# Altium schematic sheet MicroController.SchDoc: MicroController Block Diagram
size 393 x 281 mm; DocumentNumber: 14; SheetNumber: 15; SheetTotal: 44
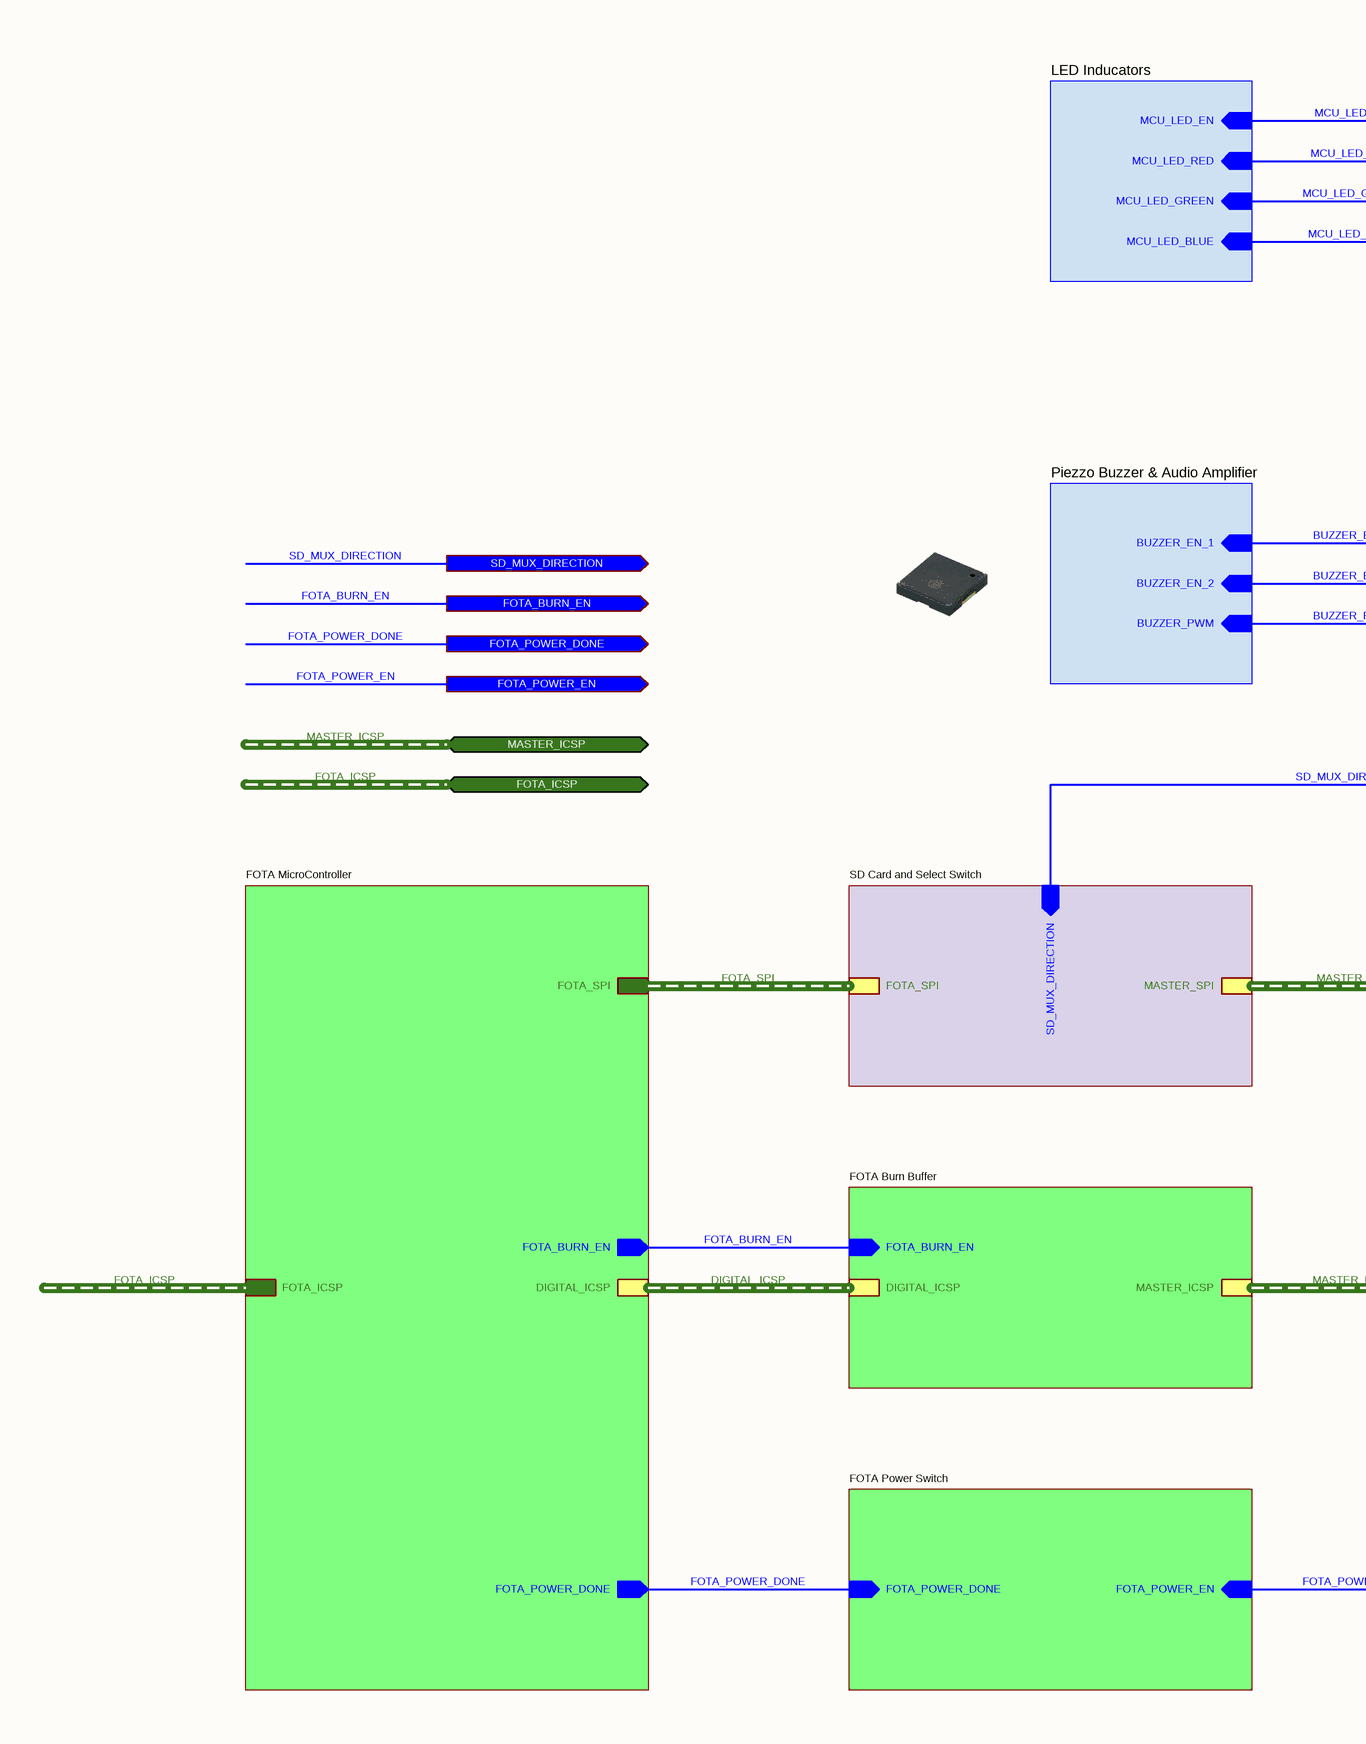
[diagram p0: MicroController.SchDoc, left]
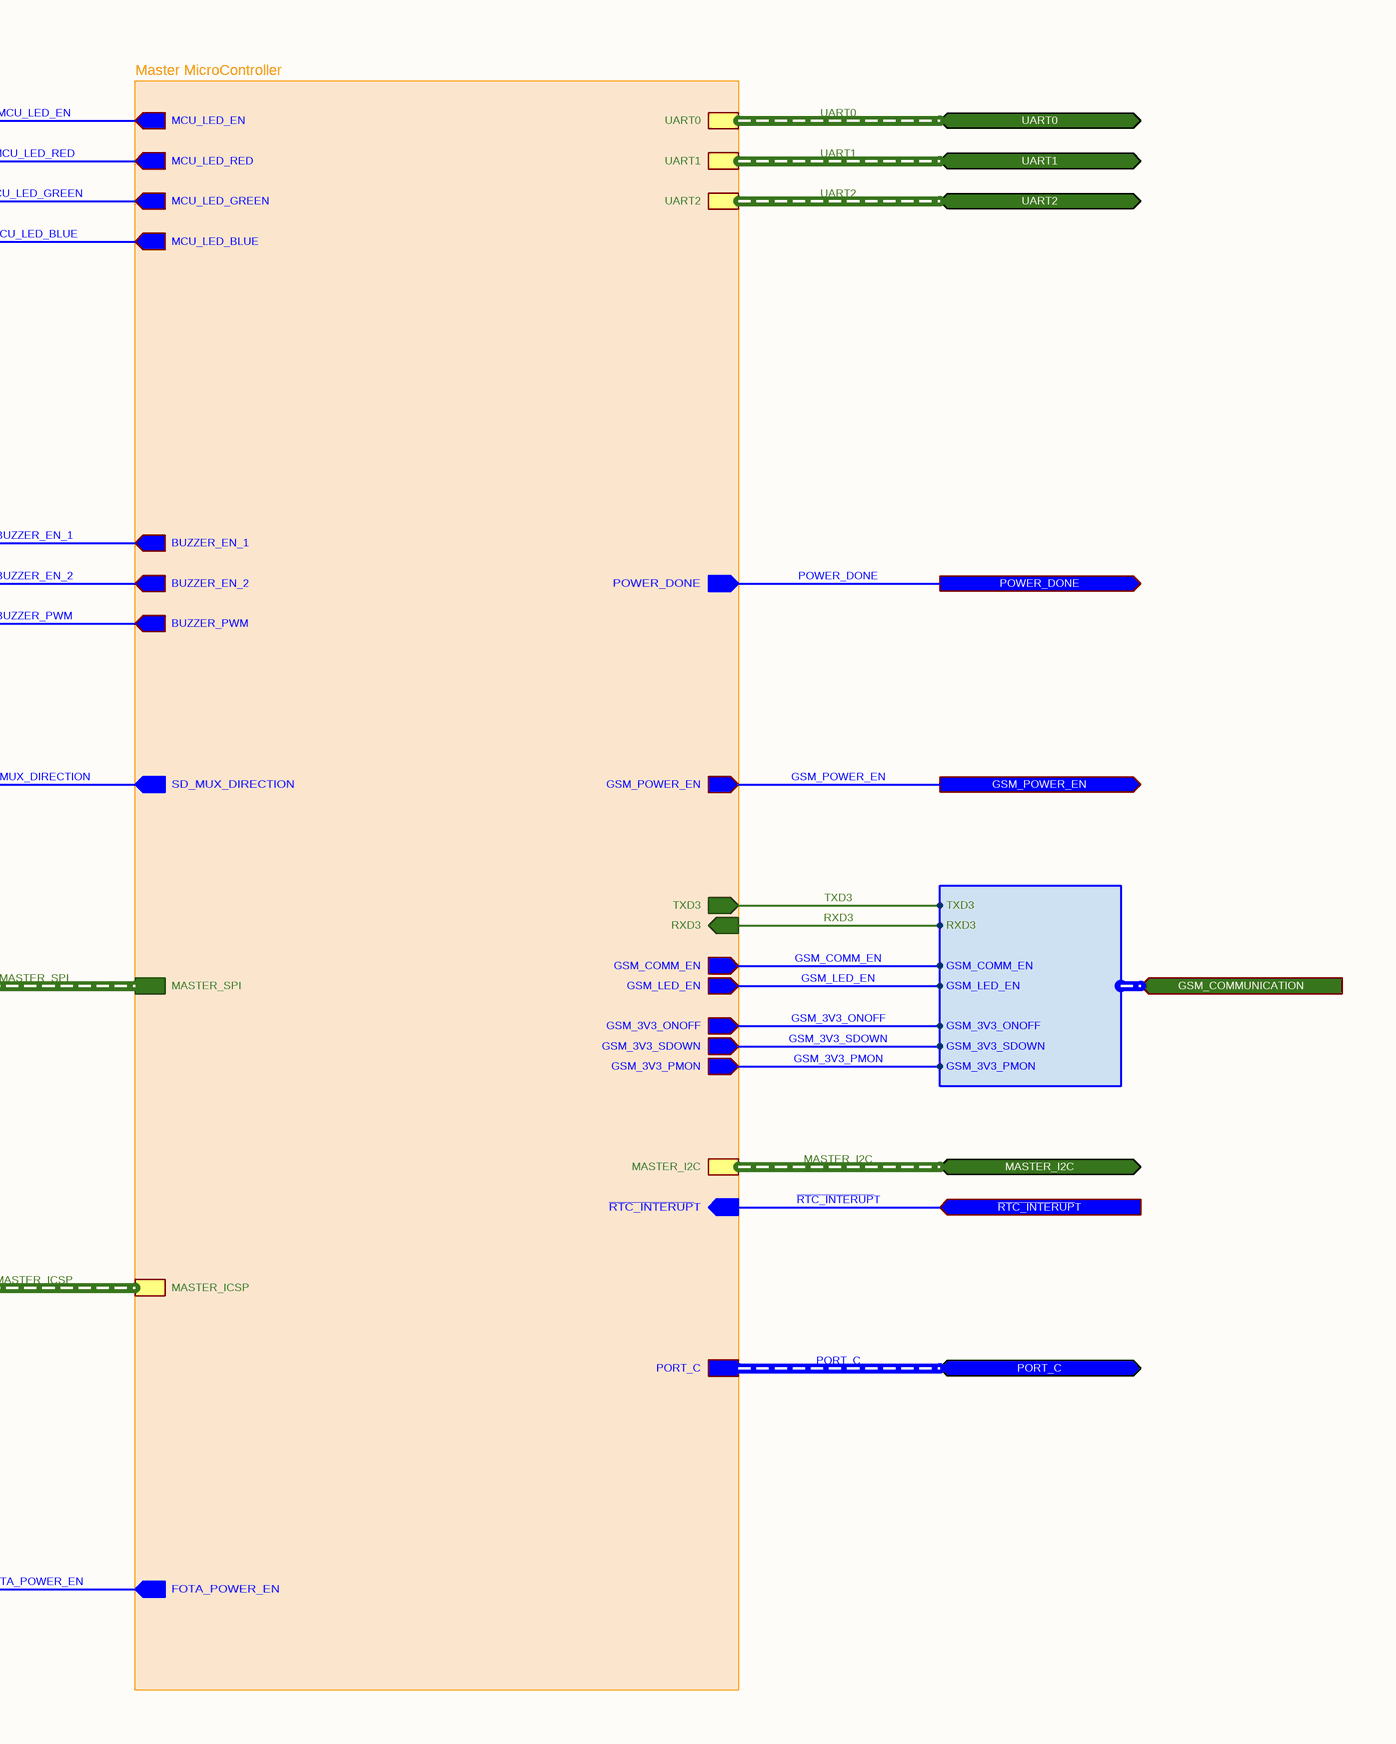
[diagram p1: MicroController.SchDoc, right]

## Sub-sheets
FOTA Burn Buffer = FOTA Burn Buffer.SchDoc: FOTA_BURN_EN (in), MASTER_ICSP (harness MASTER_ICSP), DIGITAL_ICSP (harness DIGITAL_ICSP)
FOTA MicroController = FOTA MicroController Block Diagram.SchDoc: FOTA_ICSP (harness FOTA_ICSP), FOTA_POWER_DONE (out), FOTA_SPI (harness FOTA_SPI), FOTA_BURN_EN (out), DIGITAL_ICSP (harness DIGITAL_ICSP)
FOTA Power Switch = FOTA MicroController Power Switch.SchDoc: FOTA_POWER_EN (in), FOTA_POWER_DONE (in)
LED Inducators = Master MicroController LED.SchDoc: MCU_LED_RED (in), MCU_LED_BLUE (in), MCU_LED_GREEN (in), MCU_LED_EN (in)
Master MicroController = Master MicroController.SchDoc: FOTA_POWER_EN (out), POWER_DONE (out), ~{RTC_INTERUP}T (in), SD_MUX_DIRECTION (out), UART1 (harness UART1), UART0 (harness UART0), MASTER_ICSP (harness MASTER_ICSP), UART2 (harness UART2), MASTER_I2C (harness MASTER_I2C), MASTER_SPI (harness MASTER_SPI), MCU_LED_BLUE (out), PORT_C (harness PORT_C), GSM_LED_EN (out), GSM_3V3_ONOFF (out), GSM_3V3_PMON (out), BUZZER_EN_2 (out), GSM_3V3_SDOWN (out), BUZZER_PWM (out), MCU_LED_RED (out), GSM_POWER_EN (out), MCU_LED_GREEN (out), GSM_COMM_EN (out), BUZZER_EN_1 (out), MCU_LED_EN (out), RXD3 (in), TXD3 (out)
Piezzo Buzzer & Audio Amplifier = Buzzer.SchDoc: BUZZER_EN_1 (in), BUZZER_PWM (in), BUZZER_EN_2 (in)
SD Card and Select Switch = SD Card.SchDoc: SD_MUX_DIRECTION (in), FOTA_SPI (harness FOTA_SPI), MASTER_SPI (harness MASTER_SPI)

## Ports
FOTA_BURN_EN (out), FOTA_ICSP (bidir, harness FOTA_ICSP), FOTA_POWER_DONE (out), FOTA_POWER_EN (out), GSM_COMMUNICATION (in, harness GSM_COMMUNICATION), GSM_POWER_EN (out), MASTER_I2C (bidir, harness MASTER_I2C), MASTER_ICSP (bidir, harness MASTER_ICSP), PORT_C (bidir, harness PORT_C), POWER_DONE (out), SD_MUX_DIRECTION (out), UART0 (bidir, harness UART0), UART1 (bidir, harness UART1), UART2 (bidir, harness UART2), ~{RTC_INTERUP}T (in)

## Harnesses
GSM_COMMUNICATION: GSM_3V3_ONOFF, GSM_LED_EN, GSM_COMM_EN, GSM_3V3_SDOWN, GSM_3V3_PMON, RXD3, TXD3

## Nets
~{RTC_INTERUP}T: port ~{RTC_INTERUP}T, sheet Master MicroController/~{RTC_INTERUP}T
BUZZER_EN_1: sheet Master MicroController/BUZZER_EN_1, sheet Piezzo Buzzer & Audio Amplifier/BUZZER_EN_1
BUZZER_EN_2: sheet Master MicroController/BUZZER_EN_2, sheet Piezzo Buzzer & Audio Amplifier/BUZZER_EN_2
BUZZER_PWM: sheet Master MicroController/BUZZER_PWM, sheet Piezzo Buzzer & Audio Amplifier/BUZZER_PWM
FOTA_BURN_EN: port FOTA_BURN_EN, sheet FOTA MicroController/FOTA_BURN_EN, sheet FOTA Burn Buffer/FOTA_BURN_EN
FOTA_POWER_DONE: port FOTA_POWER_DONE, sheet FOTA MicroController/FOTA_POWER_DONE, sheet FOTA Power Switch/FOTA_POWER_DONE
FOTA_POWER_EN: port FOTA_POWER_EN, sheet Master MicroController/FOTA_POWER_EN, sheet FOTA Power Switch/FOTA_POWER_EN
GSM_3V3_ONOFF: sheet Master MicroController/GSM_3V3_ONOFF, port GSM_COMMUNICATION.GSM_3V3_ONOFF
GSM_3V3_PMON: sheet Master MicroController/GSM_3V3_PMON, port GSM_COMMUNICATION.GSM_3V3_PMON
GSM_3V3_SDOWN: sheet Master MicroController/GSM_3V3_SDOWN, port GSM_COMMUNICATION.GSM_3V3_SDOWN
GSM_COMM_EN: sheet Master MicroController/GSM_COMM_EN, port GSM_COMMUNICATION.GSM_COMM_EN
GSM_LED_EN: sheet Master MicroController/GSM_LED_EN, port GSM_COMMUNICATION.GSM_LED_EN
GSM_POWER_EN: port GSM_POWER_EN, sheet Master MicroController/GSM_POWER_EN
MCU_LED_BLUE: sheet Master MicroController/MCU_LED_BLUE, sheet LED Inducators/MCU_LED_BLUE
MCU_LED_EN: sheet Master MicroController/MCU_LED_EN, sheet LED Inducators/MCU_LED_EN
MCU_LED_GREEN: sheet Master MicroController/MCU_LED_GREEN, sheet LED Inducators/MCU_LED_GREEN
MCU_LED_RED: sheet Master MicroController/MCU_LED_RED, sheet LED Inducators/MCU_LED_RED
POWER_DONE: port POWER_DONE, sheet Master MicroController/POWER_DONE
RXD3: sheet Master MicroController/RXD3, port GSM_COMMUNICATION.RXD3
SD_MUX_DIRECTION: port SD_MUX_DIRECTION, sheet Master MicroController/SD_MUX_DIRECTION, sheet SD Card and Select Switch/SD_MUX_DIRECTION
TXD3: sheet Master MicroController/TXD3, port GSM_COMMUNICATION.TXD3

## Buses and harness runs
harness DIGITAL_ICSP = sheet FOTA Burn Buffer/DIGITAL_ICSP = sheet FOTA MicroController/DIGITAL_ICSP
harness FOTA_ICSP = port FOTA_ICSP
harness FOTA_ICSP = sheet FOTA MicroController/FOTA_ICSP
harness FOTA_SPI = sheet FOTA MicroController/FOTA_SPI = sheet SD Card and Select Switch/FOTA_SPI
harness MASTER_I2C = port MASTER_I2C = sheet Master MicroController/MASTER_I2C
harness MASTER_ICSP = port MASTER_ICSP
harness MASTER_ICSP = sheet FOTA Burn Buffer/MASTER_ICSP = sheet Master MicroController/MASTER_ICSP
harness MASTER_SPI = sheet Master MicroController/MASTER_SPI = sheet SD Card and Select Switch/MASTER_SPI
harness PORT_C = port PORT_C = sheet Master MicroController/PORT_C
harness UART0 = port UART0 = sheet Master MicroController/UART0
harness UART1 = port UART1 = sheet Master MicroController/UART1
harness UART2 = port UART2 = sheet Master MicroController/UART2

## Notes on the sheet
- © 2021 All rights reserved.
  This document may not, in whole or in part, be copied, photocopied, reproduced, translated or converted to any electronic or machine readable from without prior written permission of Mehmet Günce Akkoyun.
  Engineer contact : akkoyun@me.com
- Property of
- Engineer :
- Date :
- Size :
- A3
- Time :
- Project :
- Page :
- /
- Customer :
- Product ID :
- Module ID :
- Version :
- File :
- Revision :